# Altium schematic sheet EXT_USR_LED.SchDoc
size A0
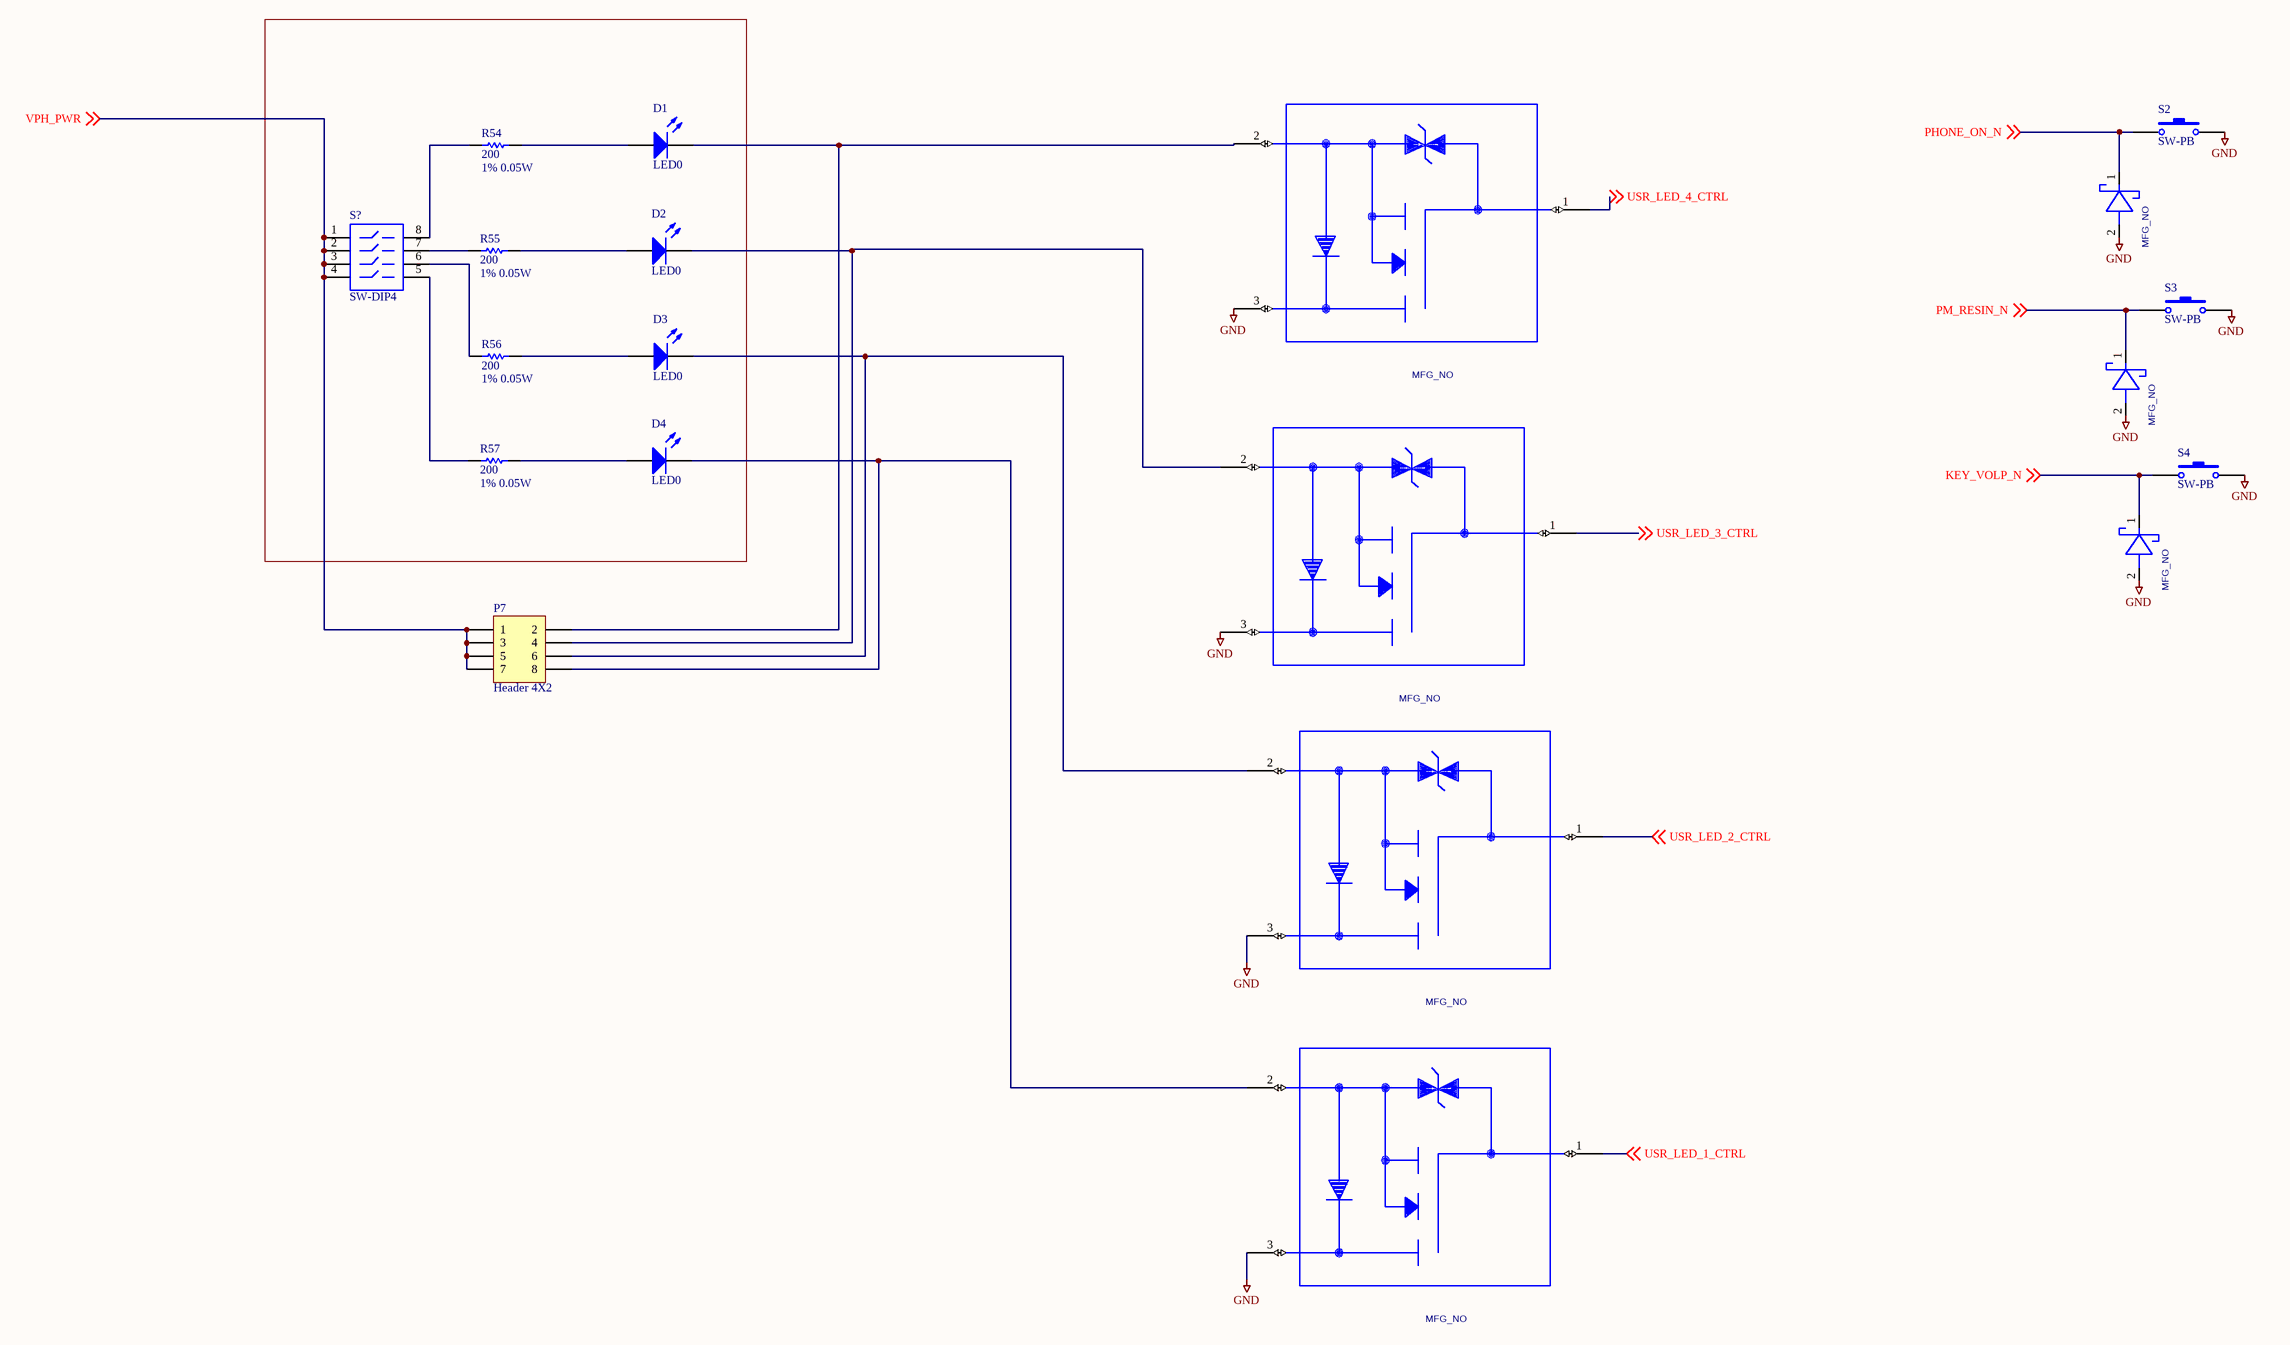
[diagram p0: EXT_USR_LED.SchDoc]

## Parts
CR0  PART_ID: MFG_NO  (hidden comment: SCHOTTKY)
CR1  PART_ID: MFG_NO  (hidden comment: SCHOTTKY)
CR2  PART_ID: MFG_NO  (hidden comment: SCHOTTKY)
D1  LED0  [LED-0]
D2  LED0  [LED-0]
D3  LED0  [LED-0]
D4  LED0  [LED-0]
P7  Header 4X2  [HDR2X4]
Q2  PART_ID: MFG_NO  (hidden comment: nfet_zener_bidir)
Q3  PART_ID: MFG_NO  (hidden comment: nfet_zener_bidir)
Q4  PART_ID: MFG_NO  (hidden comment: nfet_zener_bidir)
Q5  PART_ID: MFG_NO  (hidden comment: nfet_zener_bidir)
R54  200  value 1% 0.05W  [AXIAL-0.3]
R55  200  value 1% 0.05W  [AXIAL-0.3]
R56  200  value 1% 0.05W  [AXIAL-0.3]
R57  200  value 1% 0.05W  [AXIAL-0.3]
S2  SW-PB  [SPST-2]
S3  SW-PB  [SPST-2]
S4  SW-PB  [SPST-2]
S?  SW-DIP4  [DIP-8]

## Nets
GND: CR0.2(POS) CR1.2(POS) CR2.2(POS) Q2.3(D) Q3.3(D) Q4.3(D) Q5.3(D) S2.2 S3.2 S4.2
KEY_VOLP_N: CR2.1(NEG) S4.1 ; off-sheet KEY_VOLP_N
PHONE_ON_N: CR0.1(NEG) S2.1 ; off-sheet PHONE_ON_N
PM_RESIN_N: CR1.1(NEG) S3.1 ; off-sheet PM_RESIN_N
USR_LED_1_CTRL: Q5.1(G) ; off-sheet USR_LED_1_CTRL
USR_LED_2_CTRL: Q4.1(G) ; off-sheet USR_LED_2_CTRL
USR_LED_3_CTRL: Q3.1(G) ; off-sheet USR_LED_3_CTRL
USR_LED_4_CTRL: Q2.1(G) ; off-sheet USR_LED_4_CTRL
VPH_PWR: P7.1 P7.3 P7.5 P7.7 S?.1 S?.2 S?.3 S?.4 ; off-sheet VPH_PWR
NetD1_1: D1.1(A) R54.2
NetD1_2: D1.2(K) P7.2 Q2.2(S)
NetD2_1: D2.1(A) R55.2
NetD2_2: D2.2(K) P7.4 Q3.2(S)
NetD3_1: D3.1(A) R56.2
NetD3_2: D3.2(K) P7.6 Q4.2(S)
NetD4_1: D4.1(A) R57.2
NetD4_2: D4.2(K) P7.8 Q5.2(S)
NetR54_1: R54.1 S?.8
NetR55_1: R55.1 S?.7
NetR56_1: R56.1 S?.6
NetR57_1: R57.1 S?.5

## Library data of the parts
CR0-CR2 = SCHOTTKY: PART_NUMBER: MCN_NO; OriginalSymbolOrigin: (-100,100); CDS_LMAN_SYM_OUTLINE: -50,75,50,-75; SYMNAME: SCHOTTKY; PACK_TYPE: ?
D1-D4 = LED0: Typical INFRARED GaAs LED; Published: 8-Jun-2000; LatestRevisionDate: 08-Jul-2005; LatestRevisionNote: Mech Layer 1 removed.; PackageReference: LED-0; Publisher: Altium Limited; PackageDescription: LED; 2 Leads
P7 = Header 4X2: Header, 4-Pin, Dual row; LatestRevisionDate: 17-Jul-2002; LatestRevisionNote: Re-released for DXP Platform.; Publisher: Altium Limited
Q2-Q5 = NFET_ZENER_BIDIR: PART_NUMBER: MCN_NO; OriginalSymbolOrigin: (-525,450); CDS_LMAN_SYM_OUTLINE: -475,450,475,-450; SYMNAME: nfet_zener_bidir; PACK_TYPE: ?
R54-R57 = Res1: Resistor; Published: 8-Jun-2000; LatestRevisionDate: 17-Jul-2002; LatestRevisionNote: Re-released for DXP Platform.; PackageReference: AXIAL-0.3; Publisher: Altium Limited; PackageDescription: Axial Device, Thru-Hole; 2 Leads; 0.3 in Pin Spacing
S2-S4 = SW-PB: Switch; Published: 24-Mar-1999; LatestRevisionDate: 17-Jul-2002; LatestRevisionNote: Re-released for DXP Platform.; PackageReference: SPST-2; Publisher: Altium Limited; PackageDescription: Switch; 2 Leads
S? = SW-DIP4: DIP Switch; Published: 24-Mar-1999; LatestRevisionDate: 17-Jul-2002; LatestRevisionNote: Re-released for DXP Platform.; PackageReference: DIP-8; Publisher: Altium Limited